# EAGLE design sensnodeTXv3 (EAGLE 6.4)
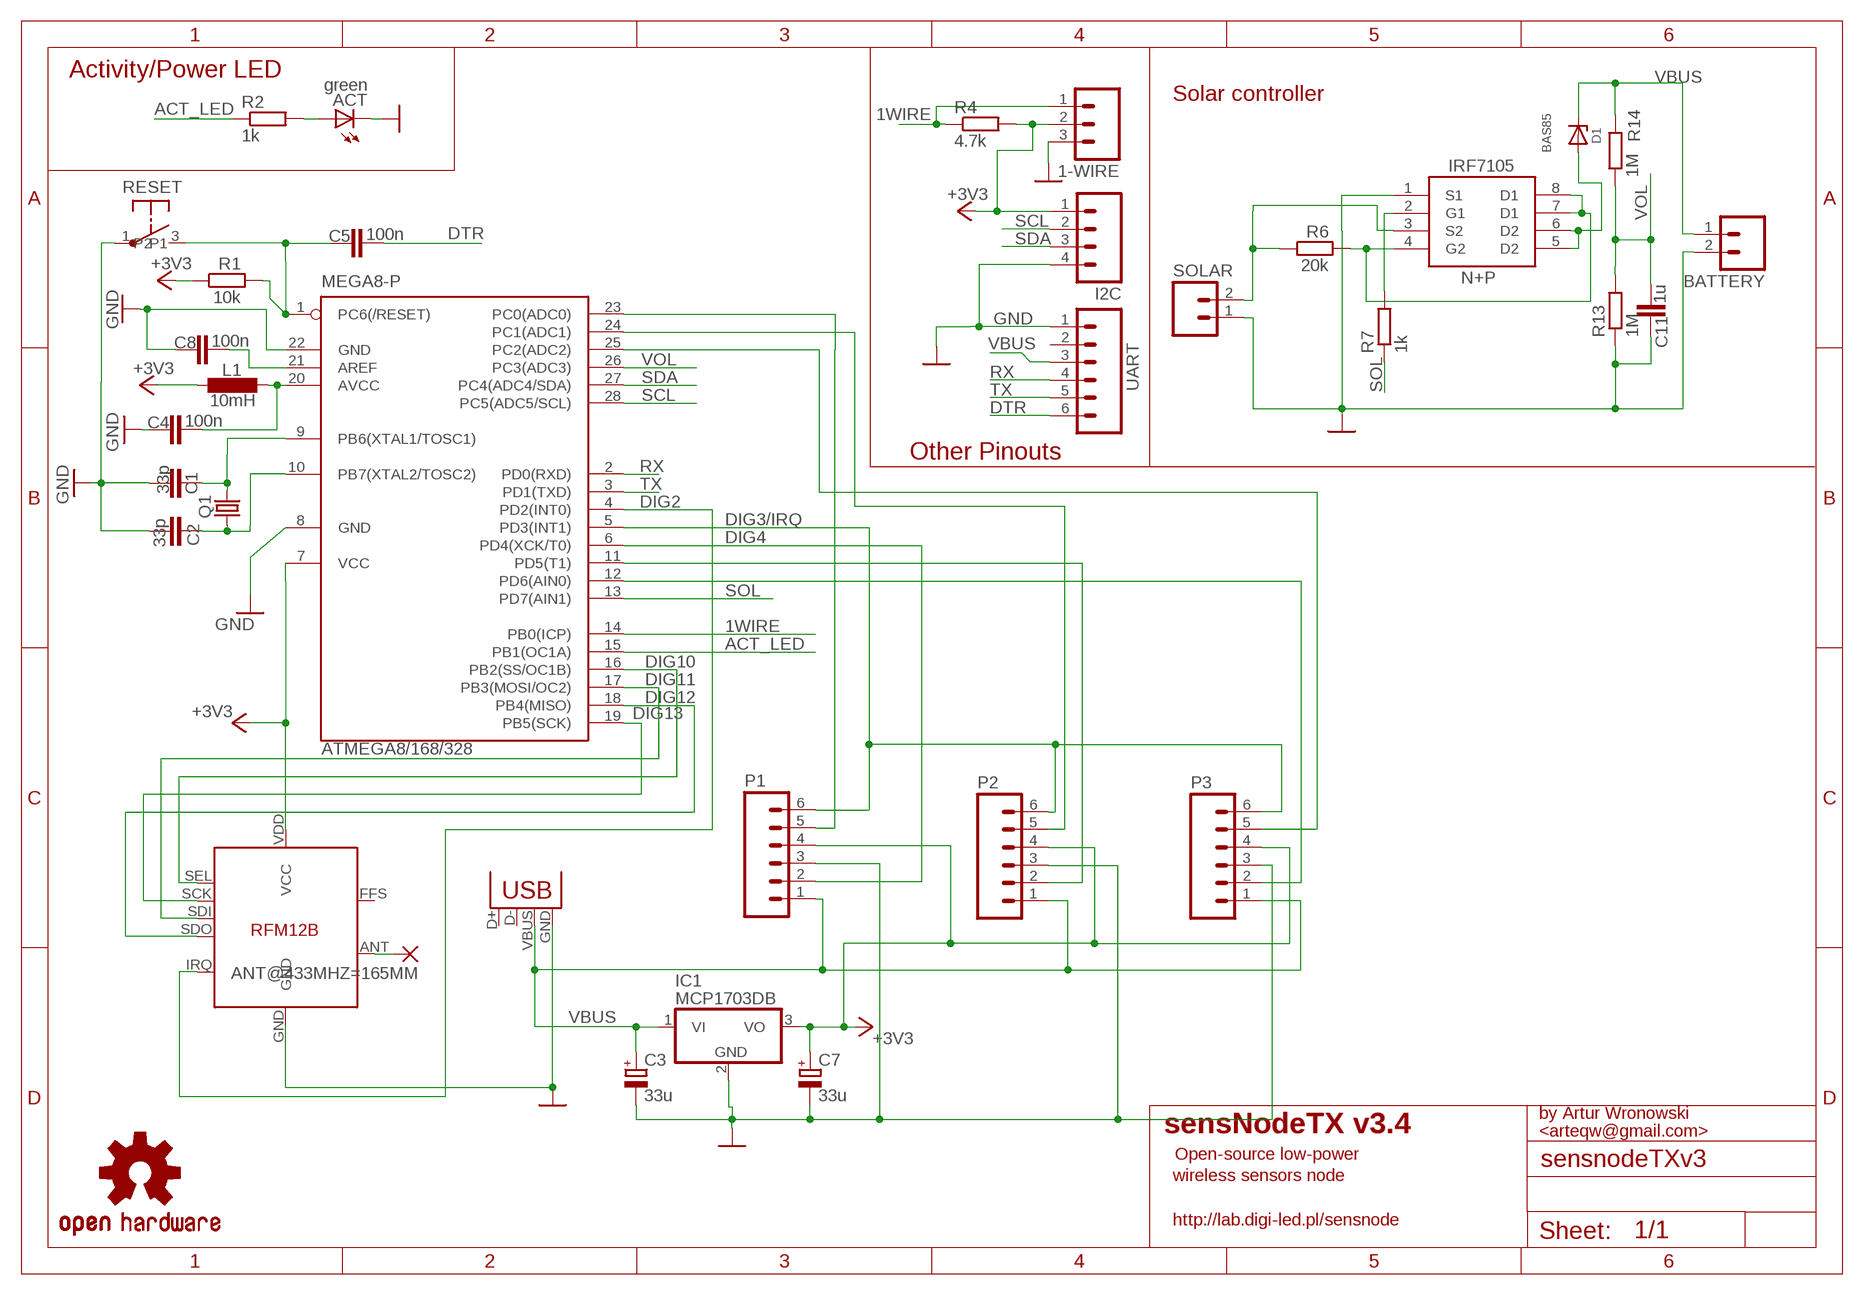
[diagram p0: schematic, sheet 1]

## Parts
1-WIRE  M03LOCK  [1X03_LOCK]
ACT  green  LEDSMT1206  [1206]
ANT@433MHZ=165MM  2,15/1,0  [2,15/1,0]
ATMEGA8/168/328  MEGA8-P  [DIL28-3]
BATTERY  M02LOCK  [1X02_LOCK]
C1  33p  C-EUC0805  [C0805]
C2  33p  C-EUC0805  [C0805]
C3  33u  CPOL-EUSMCB  [SMC_B]
C4  100n  C-EUC0805  [C0805]
C5  100n  C-EUC0805  [C0805]
C7  33u  CPOL-EUSMCB  [SMC_B]
C8  100n  C-EUC0805  [C0805]
C11  1u  C-EUC0805  [C0805]
D1  BAS85  ZENER-DIODESOD80C  [SOD80C]
I2C  M04LOCK  [1X04_LOCK]
IC1  MCP1703DB  [SOT223]
L1  10mH  L-EU0207/7  [0207/7]
P1  M06SIP_LOCK  [1X06-SIP_LOCK]
P2  M06SIP_LOCK  [1X06-SIP_LOCK]
P3  M06SIP_LOCK  [1X06-SIP_LOCK]
Q1  CRYSTALHC49U70  [HC49U70]
R1  10k  R-EU_M0805  [M0805]
R2  1k  R-EU_M0805  [M0805]
R4  4.7k  R-EU_M0805  [M0805]
R6  20k  R-EU_M0805  [M0805]
R7  1k  R-EU_M0805  [M0805]
R13  1M  R-EU_M0805  [M0805]
R14  1M  R-EU_M0805  [M0805]
RESET  TACT3X6  [TACK3X6]
RFM12B  RFM12B  [RFM12B]
SOLAR  M02LOCK  [1X02_LOCK]
U$3  OSHW-LOGOM  [OSHW-LOGO-M]
U$4  IRF7105  IRF7104  [SO8]
UART  M06SIP_LOCK  [1X06-SIP_LOCK]
USB_PWR  USBSMD  [USB-MINIB]

## Nets
1WIRE: 1-WIRE.1 ATMEGA8/168/328.14(PB0(ICP)) R4.1
+3V3: 1-WIRE.2 ATMEGA8/168/328.7(VCC) C7.+ I2C.1 IC1.3(VO) L1.1 P1.4 P2.4 P3.4 R1.1 R4.2 RFM12B.VDD(VCC)
ACT_LED: ATMEGA8/168/328.15(PB1(OC1A)) R2.1
DIG2: ATMEGA8/168/328.4(PD2(INT0)) RFM12B.IRQ
DIG3/IRQ: ATMEGA8/168/328.5(PD3(INT1)) P1.6 P2.6 P3.6
DIG4: ATMEGA8/168/328.6(PD4(XCK/T0)) P1.2
DIG10: ATMEGA8/168/328.16(PB2(SS/OC1B)) RFM12B.SEL
DIG11: ATMEGA8/168/328.17(PB3(MOSI/OC2)) RFM12B.SDI
DIG12: ATMEGA8/168/328.18(PB4(MISO)) RFM12B.SDO
DIG13: ATMEGA8/168/328.19(PB5(SCK)) RFM12B.SCK
DTR: C5.1 UART.6
GND: 1-WIRE.3 ACT.C ATMEGA8/168/328.8(GND) ATMEGA8/168/328.22(GND) BATTERY.2 C1.2 C2.2 C3.- C4.2 C7.- C8.2 C11.2 I2C.4 IC1.2(GND) P1.3 P2.3 P3.3 R13.1 RESET.1 RFM12B.GND SOLAR.1 U$4.1(S1) UART.1 USB_PWR.GND
N$1: ATMEGA8/168/328.10(PB7(XTAL2/TOSC2)) C2.1 Q1.1
N$2: ATMEGA8/168/328.9(PB6(XTAL1/TOSC1)) C1.1 Q1.2
N$3: ATMEGA8/168/328.20(AVCC) C4.1 L1.2
N$4: ATMEGA8/168/328.21(AREF) C8.1
N$5: ATMEGA8/168/328.25(PC2(ADC2)) P3.5
N$6: D1.A U$4.5(D2) U$4.6(D2)
N$7: ATMEGA8/168/328.11(PD5(T1)) P2.2
N$8: ACT.A R2.2
N$9: ATMEGA8/168/328.12(PD6(AIN0)) P3.2
N$10: ATMEGA8/168/328.24(PC1(ADC1)) P2.5
N$11: R6.1 SOLAR.2 U$4.3(S2)
N$12: R7.2 U$4.2(G1)
N$13: ATMEGA8/168/328.23(PC0(ADC0)) P1.5
N$15: R6.2 U$4.4(G2) U$4.7(D1) U$4.8(D1)
N$24: ANT@433MHZ=165MM.1(P) RFM12B.ANT
P2: ATMEGA8/168/328.1(PC6(/RESET)) C5.2 R1.2 RESET.3(P2)
RX: ATMEGA8/168/328.2(PD0(RXD)) UART.4
SCL: ATMEGA8/168/328.28(PC5(ADC5/SCL)) I2C.2
SDA: ATMEGA8/168/328.27(PC4(ADC4/SDA)) I2C.3
SOL: ATMEGA8/168/328.13(PD7(AIN1)) R7.1
TX: ATMEGA8/168/328.3(PD1(TXD)) UART.5
VBUS: BATTERY.1 C3.+ D1.C IC1.1(VI) P1.1 P2.1 P3.1 R14.2 UART.3 USB_PWR.VBUS
VOL: ATMEGA8/168/328.26(PC3(ADC3)) C11.1 R13.2 R14.1
Unconnected: RFM12B.FFS UART.2 USB_PWR.D+ USB_PWR.D-

## Notes on the sheet
- Activity/Power LED
- Solar controller
- IRF7105
- N+P
- Other Pinouts
- by Artur Wronowski
- sensNodeTX v3.4 | <arteqw@gmail.com>
- Open-source low-power
- wireless sensors node
- http://lab.digi-led.pl/sensnode

## Library data of the parts
1-WIRE = SparkFun:M03: Header 3 Standard 3-pin 0.1" header. Use with straight break away headers (SKU : PRT-00116), right angle break away headers (PRT-00553), swiss pins (PRT-00743), machine pins (PRT-00117), and female headers (PRT-00115). Molex polarized connector foot print use with SKU : PRT-08232 with associated crimp pins and housings.
ACT = adafruit:LED: LED OSRAM: - CHIPLED LG R971, LG N971, LY N971, LG Q971, LY Q971, LO R971, LY R971 LH N974, LH R974 LS Q976, LO Q976, LY Q976 LO Q996 - Hyper CHIPLED LW Q18S LB Q993, LB Q99A, LB R99A - SideLED LS A670, LO A670, LY A670, LG A670, LP A670 LB A673, LV A673, LT A673, LW A673 LH A674 LY A675 LS A676, LA A676, LO A676, LY A676, LW A676 LS A679, LY A679, LG A679 - Hyper Micro SIDELED® LS Y876, LA Y876, LO Y876, LY Y876 LT Y87S - SmartLED LW L88C, LW L88S LB L89C, LB L89S, LG L890 LS L89K, LO L89K, LY L89K LS L896, LA L896, LO L896, LY L896 - TOPLED LS T670, LO T670, LY T670, LG T670, LP T670 LSG T670, LSP T670, LSY T670, LOP T670, LYG T670 LG T671, LOG T671, LSG T671 LB T673, LV T673, LT T673, LW T673 LH T674 LS T676, LA T676, LO T676, LY T676, LB T676, LH T676, LSB T676, LW T676 LB T67C, LV T67C, LT T67C, LS T67K, LO T67K, LY T67K, LW E67C LS E67B, LA E67B, LO E67B, LY E67B, LB E67C, LV E67C, LT E67C LW T67C LS T679, LY T679, LG T679 LS T770, LO T770, LY T770, LG T770, LP T770 LB T773, LV T773, LT T773, LW T773 LH T774 LS E675, LA E675, LY E675, LS T675 LS T776, LA T776, LO T776, LY T776, LB T776 LHGB T686 LT T68C, LB T68C - Hyper Mini TOPLED® LB M676 - Mini TOPLED Santana® LG M470 LS M47K, LO M47K, LY M47K Source: http://www.osram.convergy.de/
ANT@433MHZ=165MM = wirepad:2,15/1,0: THROUGH-HOLE PAD
ATMEGA8/168/328 = atmel:MEGA8-P: MICROCONTROLLER 8 Kbytes FLASH, 1 kbytes SRAM, 512 bytes EEPROM, USART, 4-channel 10 bit ADC, 2-channel 8 bit ADC Pin compatible with Atmega48, ATMega88, ATMega168 Source: avr.lbr
BATTERY SOLAR = SparkFun:M02: Header 2 Standard 2-pin 0.1" header. Use with straight break away headers (SKU : PRT-00116), right angle break away headers (PRT-00553), swiss pins (PRT-00743), machine pins (PRT-00117), and female headers (PRT-00115). Molex polarized connector foot print use with SKU : PRT-08233 with associated crimp pins and housings.
C1 C2 C4 C5 C8 C11 = resistor:C-EU: CAPACITOR, European symbol
C3 C7 = resistor:CPOL-EU: POLARIZED CAPACITOR, European symbol
D1 = diode:ZENER-DIODE: Z-Diode
I2C = SparkFun:M04: Header 4 Standard 4-pin 0.1" header. Use with straight break away headers (SKU : PRT-00116), right angle break away headers (PRT-00553), swiss pins (PRT-00743), machine pins (PRT-00117), and female headers (PRT-00115). Molex polarized connector foot print use with SKU : PRT-08231 with associated crimp pins and housings. 1MM SMD Version SKU: PRT-10208
IC1 = linear:MCP1703: 250 mA, 16V, Low Quiescent Current LDO Regulator Source: http://ww1.microchip.com/downloads/en/DeviceDoc/22049b.pdf
L1 = resistor:L-EU: INDUCTOR, European symbol
P1-P3 UART = SparkFun:M06: Header 6 Standard 6-pin 0.1" header. Use with straight break away headers (SKU : PRT-00116), right angle break away headers (PRT-00553), swiss pins (PRT-00743), machine pins (PRT-00117), and female headers (PRT-00115). Molex polarized connector foot print use with SKU : PRT-08094 with associated crimp pins and housings. NOTES ON THE VARIANTS LOCK and LOCK_LONGPADS... This footprint was designed to help hold the alignment of a through-hole component (i.e. 6-pin header) while soldering it into place. You may notice that each hole has been shifted either up or down by 0.005 of an inch from it's more standard position (which is a perfectly straight line). This slight alteration caused the pins (the squares in the middle) to touch the edges of the holes. Because they are alternating, it causes a "brace" to hold the component in place. 0.005 has proven to be the perfect amount of "off-center" position when using our standard breakaway headers. Although looks a little odd when you look at the bare footprint, once you have a header in there, the alteration is very hard to notice. Also, if you push a header all the way into place, it is covered up entirely on the bottom side. This idea of altering the position of holes to aid alignment will be further integrated into the Sparkfun Library for other footprints. It can help hold any component with 3 or more connection pins.
Q1 = crystal:CRYSTAL: CRYSTAL; OC_FARNELL: unknown; OC_NEWARK: unknown
R1 R2 R4 R6 R7 R13 R14 = resistor:R-EU_: RESISTOR, European symbol
RESET = artek:TACT3X6
RFM12B = JeeParts:RFM12B
U$3 = SparkFun:OSHW-LOGO: Open Source Hardware Logo This logo indicates the piece of hardware it is found on incorporates a OSHW license and/or adheres to the definition of open source hardware found here: http://freedomdefined.org/OSHW
U$4 = artek:IRF7104
USB_PWR = SparkFun:USB: USB Connectors USB-B-PTH is fully proven SKU : PRT-00139 USB-miniB is fully proven SKU : PRT-00587 USB-A-PCB is untested. USB-A-H is throughly reviewed, but untested. Spark Fun Electronics SKU : PRT-00437 USB-B-SMT is throughly reviewed, but untested. Needs silkscreen touching up. USB-A-S has not been used/tested USB-MB-H has not been used/tested

## Board
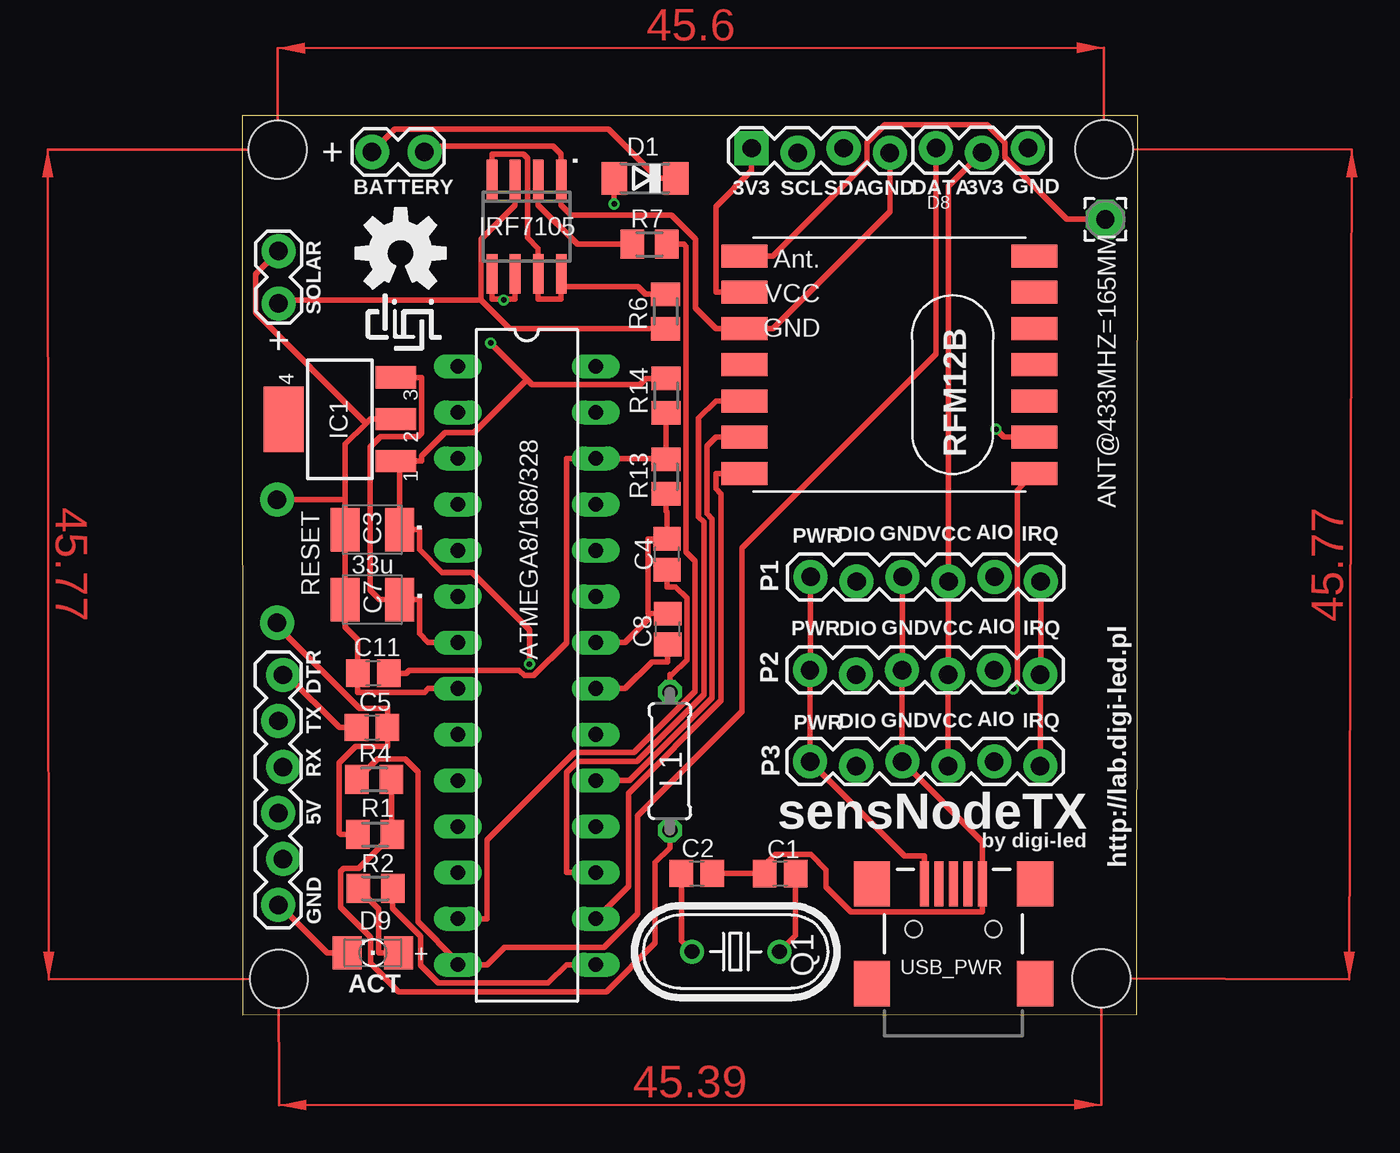
[diagram p1: board, top side]
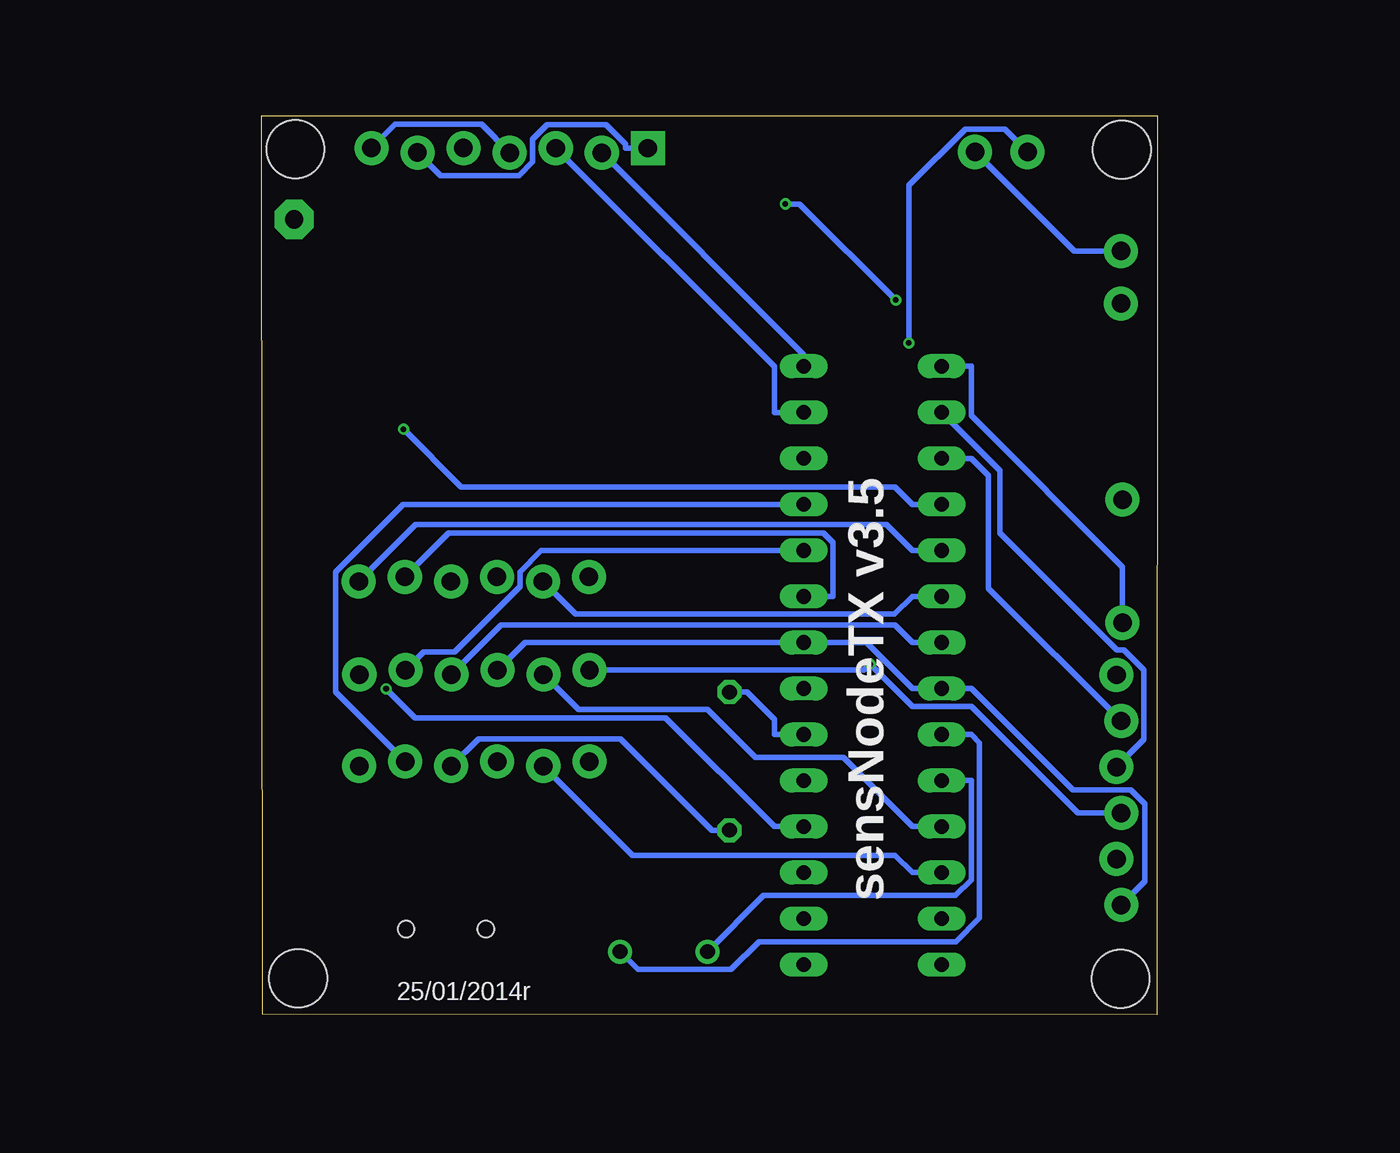
[diagram p2: board, bottom side, seen from below]

Size 49.41 x 49.61 mm. Coordinates in mm from the lower left corner, seen from the top.
Outline: 0.03,0 49.37,0.02 49.41,49.61 0,49.61 0.03,0
Copper layers (1*16): Top 0.035mm / dielectric 1.5mm / Bottom 0.035mm
Design rules "default": minimum track width 6mil, minimum drill 12mil, track to track 6mil, track to pad 6mil, pad to pad 6mil, via to via 6mil, smd to smd 0mil, copper to edge 10mil, drill to drill 10mil, minimum pad ring 10mil, minimum via ring 6mil, stop-mask expansion 2mil, vias tented up to drill 100mil, thermal gap 10mil
Holes 3.2 mm at 2.02,1.98 47.56,47.78 1.96,47.75 47.41,2.01

### Footprints (pad centres in the part's own frame; a part is rotated, then mirrored left to right if it is on the bottom)
1X03_LOCK = drill 1.016 pad 1.88: 1 0,0.127; 2 2.54,-0.127; 3 5.08,0.127
1206 = smd 1.6 x 1.803: A -1.422,0; C 1.422,0
2,15/1,0 = drill 1.016 pad 2.159 octagon: 1 0,0
DIL28-3 = drill 0.813 long: 1 -16.51,-3.81; 2 -13.97,-3.81; 3 -11.43,-3.81; 4 -8.89,-3.81; 5 -6.35,-3.81; 6 -3.81,-3.81; 7 -1.27,-3.81; 8 1.27,-3.81; 9 3.81,-3.81; 10 6.35,-3.81; 11 8.89,-3.81; 12 11.43,-3.81; 13 13.97,-3.81; 14 16.51,-3.81; 15 16.51,3.81; 16 13.97,3.81; 17 11.43,3.81; 18 8.89,3.81; 19 6.35,3.81; 20 3.81,3.81; 21 1.27,3.81; 22 -1.27,3.81; 23 -3.81,3.81; 24 -6.35,3.81; 25 -8.89,3.81; 26 -11.43,3.81; 27 -13.97,3.81; 28 -16.51,3.81
1X02_LOCK = drill 1.016 pad 1.88: 1 -0.178,0; 2 2.718,0
C0805 = smd 1.3 x 1.5: 1 -0.85,0; 2 0.85,0
SMC_B = smd 1.6 x 2.4: + -1.5,0; - 1.5,0
SOD80C = smd 1.4 x 1.8: A 1.7,0; C -1.7,0
1X04_LOCK = drill 1.016 pad 1.88 square: 1 0,0.127 | drill 1.016 pad 1.88: 2 2.54,-0.127; 3 5.08,0.127; 4 7.62,-0.127
SOT223 = smd 1.219 x 2.235: 1 -2.311,-3.099; 2 0,-3.099; 3 2.311,-3.099 | smd 3.6 x 2.2: 4 0,3.099
0207/7 = drill 0.813 octagon: 1 -3.81,0; 2 3.81,0
1X06-SIP_LOCK = drill 1.016 pad 1.88: 1 0,0; 2 2.54,-0.254; 3 5.08,0; 4 7.62,-0.254; 5 10.16,0; 6 12.7,-0.254
HC49U70 = drill 0.813: 1 -2.413,0; 2 2.413,0
M0805 = smd 1.3 x 1.6: 1 -0.95,0; 2 0.95,0
TACK3X6 = drill 1.016 pad 1.88: 1 -1.981,3.261; 3 -1.981,-3.531
RFM12B = smd 2.54 x 1.27: ANT 8,-6; FFS -8,2; GND 8,-2; IRQ -8,4; P$8 -8,0; P$9 -8,-2; P$10 -8,-4; P$12 -8,-6; P$16 8,0; SCK 8,4; SDI 8,2; SDO -8,6; SEL 8,6; VDD 8,-4
SO8 = smd 0.6 x 2.2: 1 -1.905,-2.854; 2 -0.635,-2.854; 3 0.635,-2.854; 4 1.905,-2.854; 5 1.905,2.346; 6 0.635,2.346; 7 -0.635,2.346; 8 -1.905,2.346
USB-MINIB = smd 2.5 x 0.5: D+ 2.5,0; D- 2.5,0.8; GND 2.5,-1.6; ID 2.5,-0.8; VBUS 2.5,1.6 | smd 2.5 x 2: MTN1 -3,4.5; MTN2 2.5,4.5; MTN3 -3,-4.5; MTN4 2.5,-4.5 | hole 0.9: 0,2.2; 0,-2.2

### Placement (x,y rotation side)
1-WIRE  38.28,47.71 0 top
ACT  7.21,3.42 180 top
ANT@433MHZ=165MM  47.63,43.9 0 top
ATMEGA8/168/328  15.7,19.28 270 top
BATTERY  7.33,47.62 0 top
C1  29.69,7.79 180 top
C2  25.08,7.8 0 top
C3  7.18,26.78 180 top
C4  23.44,25.42 90 top
C5  7.16,15.86 0 top
C7  7.18,22.92 180 top
C8  23.48,21.29 90 top
C11  7.23,18.85 180 top
D1  22.22,46.17 180 top
I2C  28.11,47.7 0 top
IC1  5.38,32.87 90 top
L1  23.6,14 90 top
P1  31.36,24.17 0 top
P2  31.33,19.03 0 top
P3  31.34,13.98 0 top
Q1  27.23,3.49 0 top
R1  7.33,9.95 180 top
R2  7.35,6.98 180 top
R4  7.28,12.98 0 top
R6  23.36,38.82 90 top
R7  22.48,42.52 180 top
R13  23.38,29.7 90 top
R14  23.39,34.18 90 top
RESET  3.9,25.17 0 top
RFM12B  35.71,35.88 180 top
SOLAR  2,41.98 270 top
U$3  8.73,42.04 0 top
U$4  15.7,43.24 180 top
UART  1.99,6.06 90 top
USB_PWR  39.25,4.73 90 top

### Tracks (layer width: path | path; a pad name or v marks a point on that pad's centre or on a via)
1WIRE
  Top 0.3: R4.1 7.47,14.12 8.99,14.12 9.69,13.42 9.69,5.13 11.89,2.94 ATMEGA8/168/328.14 13.51,2.77 14.48,3.73 19.97,3.73 21.81,5.57 21.81,10.99 27.58,16.75 27.58,25.76 38.28,36.47 1-WIRE.1
+3V3
  Top 0.3: I2C.1 28.11,46.59 26.14,44.61 26.14,39.88 RFM12B.VDD | ATMEGA8/168/328.7 10.27,20.55 9.78,21.03 9.78,22.92 C7.+ 7.58,22.92 7.06,23.44 7.06,31.33 7.64,31.91 9.69,31.91 9.9,32.12 9.9,35.18 IC1.3 | 8.23,9.95 R1.1 | 8.23,9.95 8.23,9.9 6.42,8.09 5.59,8.09 5.43,7.92 5.43,5.92 7.08,4.27 7.08,2.83 8.63,1.28 20.1,1.28 22.78,3.96 22.78,8.41 23.6,9.23 L1.1 | 8.23,9.95 8.23,11.88 R4.2 | 1-WIRE.2 38.98,45.74 P1.4 38.98,18.81 P2.4 P3.4
  Bottom 0.3: L1.1 24.56,10.19 29.61,15.24 37.45,15.24 P3.4 | I2C.1 29.35,47.83 29.35,48.06 30.41,49.11 33.67,49.11 34.46,48.33 34.46,47.08 35.22,46.32 39.55,46.32 1-WIRE.2 | ATMEGA8/168/328.7 13.51,20.55 14.48,21.51 36.21,21.51 P2.4
ACT_LED
  Top 0.3: ATMEGA8/168/328.15 17.89,2.77 16.89,1.77 10.8,1.77 9.84,2.73 9.84,4.34 8.3,5.88 R2.1
DIG2  (via drill 0.3 pad 0.61)
  Top 0.3: RFM12B.IRQ 42.04,31.88 v41.6,32.32
  Bottom 0.3: ATMEGA8/168/328.4 13.51,28.17 14.48,29.13 38.41,29.13 v41.6,32.32
DIG3/IRQ
  Top 0.3: P1.6 44.06,18.81 P2.6 44.04,18.77 P3.6
  Bottom 0.3: P1.6 40.93,27.05 14.93,27.05 13.51,25.63 ATMEGA8/168/328.5
DIG4
  Bottom 0.3: ATMEGA8/168/328.6 13.51,23.09 14.49,22.11 32.1,22.11 P1.2
DIG10
  Top 0.3: RFM12B.SEL 26.14,29.88 26.14,29.04 26.42,28.75 26.42,17.35 21.3,12.23 21.3,7.1 ATMEGA8/168/328.16
DIG11
  Top 0.3: RFM12B.SDI 26.14,33.88 25.18,32.93 25.18,27.48 25.48,27.18 25.48,17.69 21.77,13.98 18.5,13.98 17.89,13.37 17.89,7.85 ATMEGA8/168/328.17
DIG12  (via drill 0.3 pad 0.61)
  Top 0.3: RFM12B.SDO 42.79,28.96 42.79,18.23 v42.55,17.99
  Bottom 0.3: ATMEGA8/168/328.18 21.13,10.39 27.14,16.39 40.96,16.39 v42.55,17.99
DIG13
  Top 0.3: RFM12B.SCK 26.14,31.88 25.64,31.38 25.64,27.67 25.93,27.37 25.93,17.5 21.36,12.93 21.13,12.93 ATMEGA8/168/328.19
DTR
  Top 0.3: C5.1 5.36,15.86 2.46,18.76 UART.6
GND
  Top 0.3: 22.43,22.14 22.39,22.18 22.39,26.27 C4.2 23.44,27.74 23.38,27.8 R13.1 | C8.2 22.43,22.14 | ATMEGA8/168/328.22 21.13,20.55 22.43,21.84 22.43,22.14 | 6.83,32.64 7.06,32.87 IC1.2 | 5.68,28.43 5.68,31.49 6.83,32.64 | SOLAR.1 0.73,40.88 0.73,38.75 6.83,32.64 | 5.68,28.43 5.68,27.53 C3.- C7.- 5.68,21.42 6.38,20.72 C11.2 6.38,17.8 10.05,17.8 10.27,18.01 ATMEGA8/168/328.8 | 5.68,28.43 RESET.1 | BATTERY.2 10.38,47.95 17.15,47.95 17.61,47.5 U$4.1 17.61,44.69 18.15,44.15 23.69,44.15 25.02,42.82 25.02,39 26.14,37.88 RFM12B.GND 29.28,37.88 35.73,44.33 I2C.4 | ACT.C 4.69,3.42 2.05,6.06 UART.1 | 28.36,7.8 29.41,8.84 31.38,8.84 32.22,8 32.22,7.05 33.6,5.68 40.85,5.68 USB_PWR.GND 40.85,9.55 P3.3 P2.3 36.44,19.06 P1.3 | 28.36,7.8 28.36,7.79 C1.2 | 28.36,7.8 26.88,7.8 C2.2
  Bottom 0.3: SOLAR.1 4.58,42.16 BATTERY.2 | UART.1 0.7,7.36 0.7,11.65 1.45,12.41 4.67,12.41 10.27,18.01 ATMEGA8/168/328.8 13.51,18.01 16.05,20.55 17.89,20.55 | 17.89,20.55 ATMEGA8/168/328.22 34.89,20.55 P2.3 | 17.89,20.55 | I2C.4 37.3,49.14 42.06,49.14 1-WIRE.3
N$1
  Top 0.3: Q1.1 24.23,4.08 C2.1
  Bottom 0.3: ATMEGA8/168/328.10 10.27,12.93 10.27,7.45 11.13,6.58 21.73,6.58 Q1.1
N$2
  Top 0.3: Q1.2 30.54,4.38 C1.1
  Bottom 0.3: ATMEGA8/168/328.9 10.27,15.47 9.81,15.01 9.81,5.34 11.11,4.04 21.97,4.04 23.51,2.5 28.65,2.5 Q1.2
N$3
  Top 0.3: C4.1 23.44,23.62 23.92,23.62 24.53,23 24.53,19.59 23.71,18.77 23.6,18.77 L1.2
  Bottom 0.3: ATMEGA8/168/328.20 21.13,15.47 21.13,16.31 22.64,17.81 L1.2
N$4
  Top 0.3: ATMEGA8/168/328.21 21.13,18.01 22.61,19.49 23.48,19.49 C8.1
N$5
  Bottom 0.3: ATMEGA8/168/328.25 41.61,28.17 45.33,24.44 45.33,17.81 P3.5
N$6  (via drill 0.3 pad 0.61)
  Top 0.3: U$4.6 15.06,39.49 14.43,39.49 | 14.43,39.49 v14.43,39.45 | 14.43,39.49 13.79,39.49 U$4.5 | v20.52,44.75 20.52,44.97 D1.A
  Bottom 0.3: v14.43,39.45 19.74,44.75 v20.52,44.75
N$7
  Bottom 0.3: P2.2 31.94,16.85 24.82,16.85 22.18,14.2 17.32,14.2 13.51,10.39 ATMEGA8/168/328.11
N$8
  Top 0.3: ACT.A 7.53,3.42 7.53,5.86 R2.2
N$9
  Bottom 0.3: P3.2 28.97,8.81 14.48,8.81 13.51,7.85 ATMEGA8/168/328.12
N$10
  Bottom 0.3: ATMEGA8/168/328.24 33.99,25.63 35.17,24.45 35.17,23.64 38.78,20.03 40.49,20.03 P2.5
N$11
  Top 0.3: 13.18,39.45 14.76,37.87 R6.1 | 13.18,39.45 13.18,42.8 15.06,44.69 U$4.3 | 13.18,39.45 2.19,39.45 SOLAR.2
N$12
  Top 0.3: U$4.2 16.34,44.69 18.51,42.52 R7.2
N$13
  Bottom 0.3: ATMEGA8/168/328.23 17.89,23.09 17.89,26.06 18.42,26.6 39.09,26.6 P1.5
N$15
  Top 0.3: R6.2 22.26,39.77 21.84,40.19 17.61,40.19 | 17.61,40.19 17.61,39.49 16.34,39.49 U$4.7 16.34,42.3 15.73,42.9 15.73,47.28 15.52,47.5 13.79,47.5 U$4.4 | U$4.8 17.61,40.19
N$24
  Top 0.3: RFM12B.ANT 29.28,41.88 34.46,47.06 34.46,48.12 35.47,49.13 41.11,49.13 42.09,48.14 42.09,47.32 45.52,43.9 ANT@433MHZ=165MM.1
P2
  Top 0.3: RESET.3 1.92,21.47 6.47,16.91 8.01,16.91 C5.2 8.01,14.81 6.25,14.81 5.35,13.91 5.35,10.03 5.43,9.95 R1.2
  Bottom 0.3: RESET.3 1.92,24.72 10.27,33.07 10.27,35.79 ATMEGA8/168/328.1
RX
  Bottom 0.3: ATMEGA8/168/328.2 8.67,30.03 8.67,26.59 2.22,20.14 1.85,20.14 0.74,19.02 0.74,15.19 UART.4
SCL
  Bottom 0.3: I2C.2 19.51,36.43 ATMEGA8/168/328.28
SDA
  Bottom 0.3: I2C.3 21.13,35.77 21.13,33.25 ATMEGA8/168/328.27
SOL
  Top 0.3: ATMEGA8/168/328.13 13.51,5.31 13.51,9.65 18.33,14.47 21.62,14.47 24.99,17.84 24.99,25.04 24.5,25.53 24.5,42.41 24.38,42.52 R7.1
TX
  Bottom 0.3: ATMEGA8/168/328.3 10.27,30.71 9.31,29.75 9.31,23.54 UART.5
VBUS  (via drill 0.3 pad 0.61)
  Top 0.3: v15.85,19.36 15.85,21.25 12.68,24.42 11.04,24.42 9.78,25.68 9.78,26.78 C3.+ 8.68,30.05 9.19,30.56 | 15.72,35.06 v13.71,37.08 | 15.72,35.06 15.99,34.79 21.96,34.79 22.29,35.13 R14.2 | 15.72,35.06 12.8,32.14 11.21,32.14 9.9,30.83 9.9,30.56 9.19,30.56 | IC1.1 9.19,30.56 | D1.C 22.92,46.17 20.22,48.87 8.4,48.87 BATTERY.1 | USB_PWR.VBUS 37.65,8.78 36.54,8.78 P3.1 P2.1 31.36,19.06 P1.1
  Bottom 0.3: UART.3 4.37,11.14 10.25,17.02 13.51,17.02 v15.85,19.36 16.18,19.03 P2.1 | BATTERY.1 8.42,48.89 10.6,48.89 13.71,45.78 v13.71,37.08
VOL
  Top 0.3: 23.38,30.71 R13.2 | 23.38,30.71 23.38,32.26 23.39,32.27 R14.1 | 23.38,30.71 21.13,30.71 ATMEGA8/168/328.26 17.89,30.71 17.89,20.52 16.09,18.72 15.57,18.72 15.27,19.01 9.19,19.01 9.03,18.85 C11.1
(copper drawn outside any net)
  shapes: Top area x5

### Text on the board
tNames: + | . | 3V3 | SCL | SDA | GND | DATA | 3V3 | GND | D8 | + | . | PWR | DIO | GND | VCC | AIO | IRQ | . | PWR | DIO | GND | VCC | AIO | IRQ | http://lab.digi-led.pl | DTR | TX | PWR | DIO | GND | VCC | AIO | IRQ | RX | sensNodeTX | 5V | by digi-led | GND | D9 | +
bNames: sensNodeTX v3.5 | 25/01/2014r